# EAGLE schematic 2ModuleBoard (EAGLE 6.3)
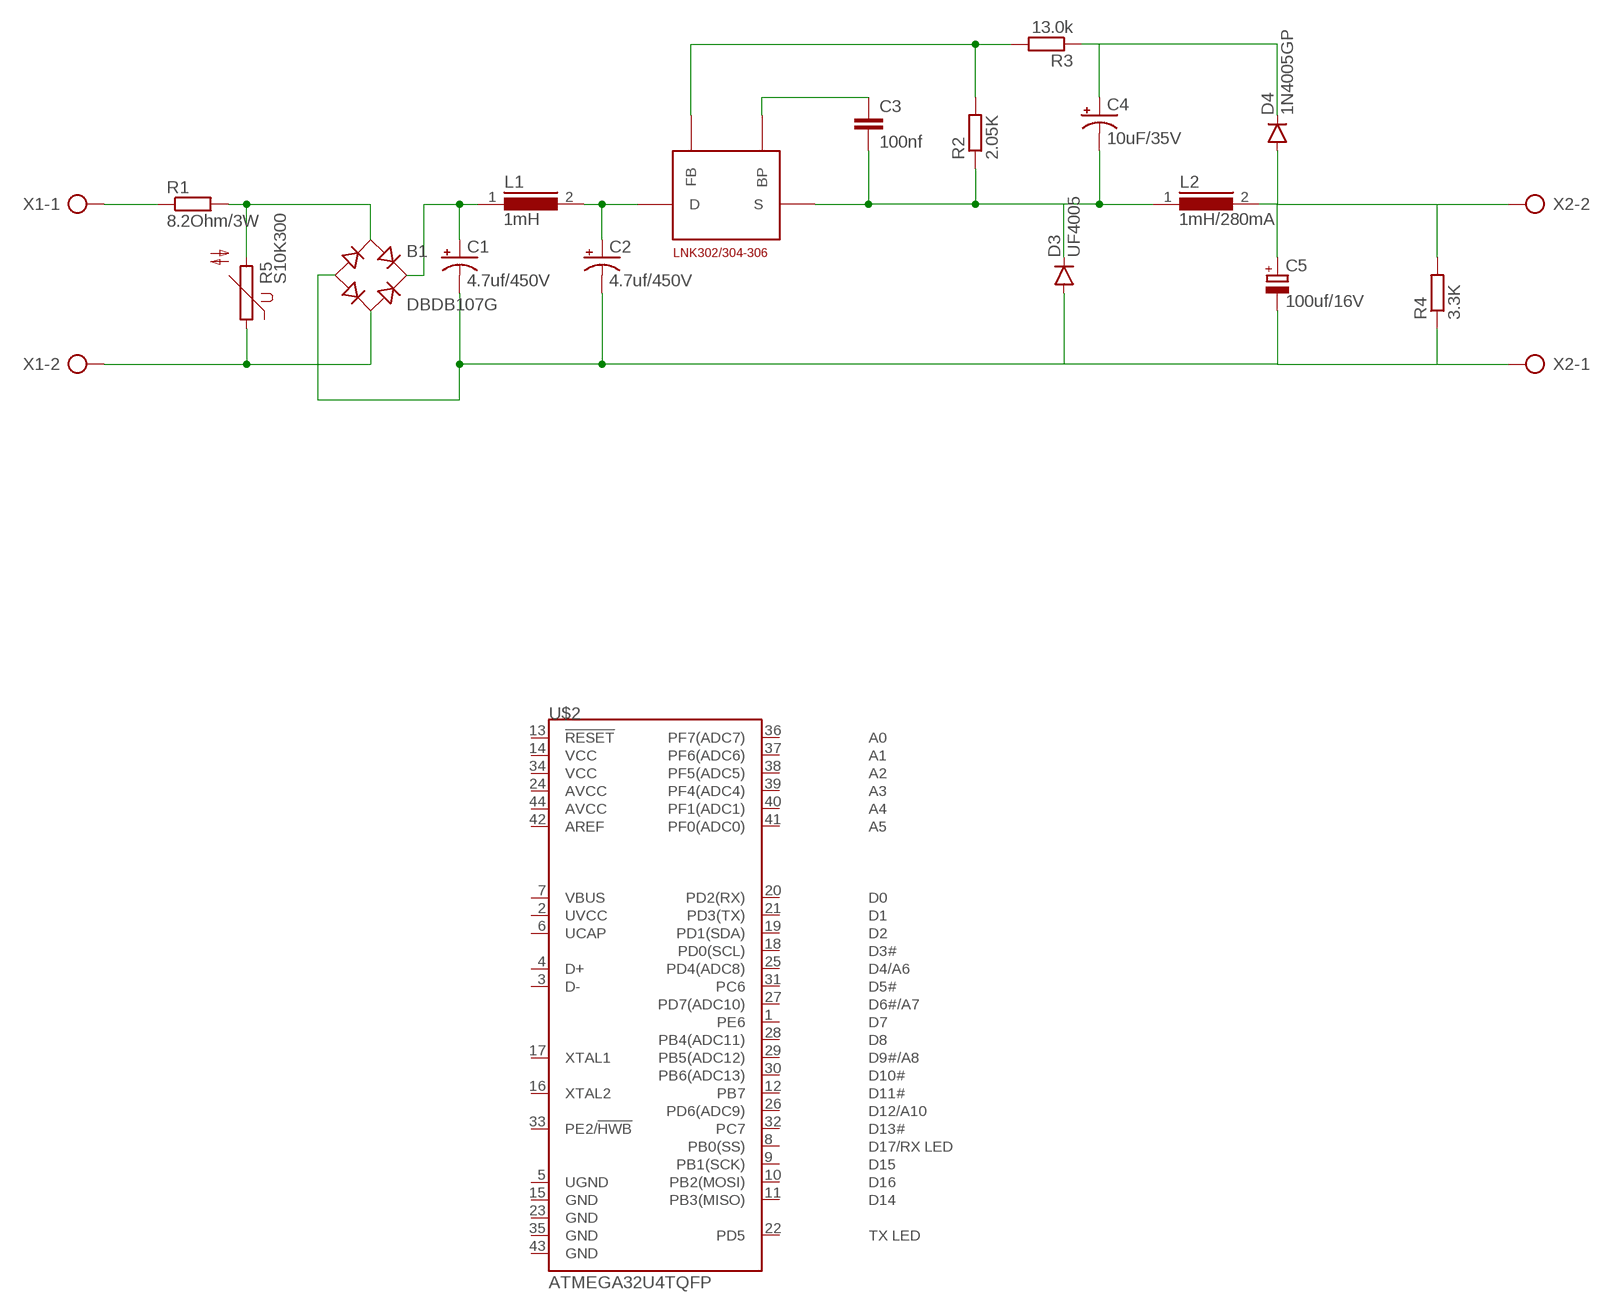
[diagram p0: schematic, sheet 1]

## Parts
B1  DBDB107G  [DB]
C1  4.7uf/450V  1000UF-25V(PTH)KIT  [CPOL-RADIAL-1000UF-25V-KIT]
C2  4.7uf/450V  1000UF-25V(PTH)KIT  [CPOL-RADIAL-1000UF-25V-KIT]
C3  100nf  C2.5/4  [C2.5-4]
C4  10uF/35V  10UF-TANT  [EIA3216]
C5  100uf/16V  CPOL-EUE2.5-7  [E2,5-7]
D3  UF4005  DIODEKIT  [DIODE-1N4148-KIT]
D4  1N4005GP  DIODEKIT  [DIODE-1N4148-KIT]
L1  1mH  82114R  [82114R]
L2  1mH/280mA  82114R  [82114R]
R1  8.2Ohm/3W  R-EU_0411/15  [0411/15]
R2  2.05K  R-EU_M1206  [M1206]
R3  13.0k  R-EU_M1206  [M1206]
R4  3.3K  R-EU_M1206  [M1206]
R5  S10K300  [S10K300]
U$1  LNK302/304-306  [SMD-8B]
U$2  ATMEGA32U4TQFP  [SPARKFUN-DIGITALIC_TQFP44]
X1  AK300/2  [AK300/2]
X2  AK300/2  [AK300/2]

## Nets
N$1: R1.1 X1.1
N$2: B1.AC1 R1.2 R5.2
N$3: B1.+ C1.+ L1.1
N$4: C2.+ L1.2 U$1.D
N$5: B1.AC2 R5.1 X1.2
N$6: B1.- C1.- C2.- C5.- D3.A R4.1 X2.1
N$7: C3.2 C4.C(-) D3.C L2.1 R2.1 U$1.S1(S)
N$8: C3.1 U$1.BP
N$9: R2.2 R3.2 U$1.FB
N$10: C4.A(+) D4.C R3.1
N$11: C5.+ D4.A L2.2 R4.2 X2.2
Unconnected: U$2.1(PE6) U$2.2(UVCC) U$2.3(D-) U$2.4(D+) U$2.5(UGND) U$2.6(UCAP) U$2.7(VBUS) U$2.8(PB0(SS)) U$2.9(PB1(SCK)) U$2.10(PB2(MOSI)) U$2.11(PB3(MISO)) U$2.12(PB7) U$2.13(!RESET) U$2.14(VCC) U$2.15(GND) U$2.16(XTAL2) U$2.17(XTAL1) U$2.18(PD0(SCL)) U$2.19(PD1(SDA)) U$2.20(PD2(RX)) U$2.21(PD3(TX)) U$2.22(PD5) U$2.23(GND) U$2.24(AVCC) U$2.25(PD4(ADC8)) U$2.26(PD6(ADC9)) U$2.27(PD7(ADC10)) U$2.28(PB4(ADC11)) U$2.29(PB5(ADC12)) U$2.30(PB6(ADC13)) U$2.31(PC6) U$2.32(PC7) U$2.33(PE2/!HWB) U$2.34(VCC) U$2.35(GND) U$2.36(PF7(ADC7)) U$2.37(PF6(ADC6)) U$2.38(PF5(ADC5)) U$2.39(PF4(ADC4)) U$2.40(PF1(ADC1)) U$2.41(PF0(ADC0)) U$2.42(AREF) U$2.43(GND) U$2.44(AVCC)

## Library data of the parts
B1 = rectifier:DB?*G: Single Phase 1.0 AMP Glass Passivated Bridge Rectifier Taiwan Semiconductor Co.,Ltd. - TSC Source: http://www.taiwansemi.com/TSCbig5/ezcatfiles/cust/img/img/db101g.pdf http://www.ts.com.tw/db/pictures/modules/PDT/PDT060207001/DBLS201G.pdf
C1 C2 = SparkFun-Capacitors:1000UF-25V(PTH): CAP-08070; PROD_ID: CAP-09538; VALUE: 1000uf/25V
C3 = capacitor-wima:C: CAPACITOR naming: grid - package width
C4 = SparkFun-Retired:10UF-TANT: 10uF Tantalum SMT CAP-00811- 16V 10% (EIA-3216); PROD_ID: CAP-00811; VALUE: 10uF
C5 = rcl:CPOL-EU: POLARIZED CAPACITOR, European symbol
D3 D4 = SparkFun-DiscreteSemi:DIODE: Diode These are standard reverse protection diodes and small signal diodes. SMA package can handle up to about 1A. SOD-323 can handle about 200mA. What the SOD-323 package when ordering, there are some mfgs out there that are 5-pin packages.
L1 L2 = inductors:82114R: INDUCTOR
R1-R4 = rcl:R-EU_: RESISTOR, European symbol
R5 = varistor:S10K300: VARISTOR
U$1 = linkswitch:LNK302/304-306
U$2 = SparkFun-Retired:ATMEGA32U4: Atmel 44-pin 8-bit Microcontroller with 32KBytes of ISP Flash and USB Controller ----- Please use the QFN-44-NOPAD_1:1 package for the footprint of all boards using a 32U4. Route traces directly away from the pads as much as possible.; PROD_ID: IC-11161
X1 X2 = con-ptr500:AK300/2: CONNECTOR; OC_FARNELL: unknown; OC_NEWARK: unknown